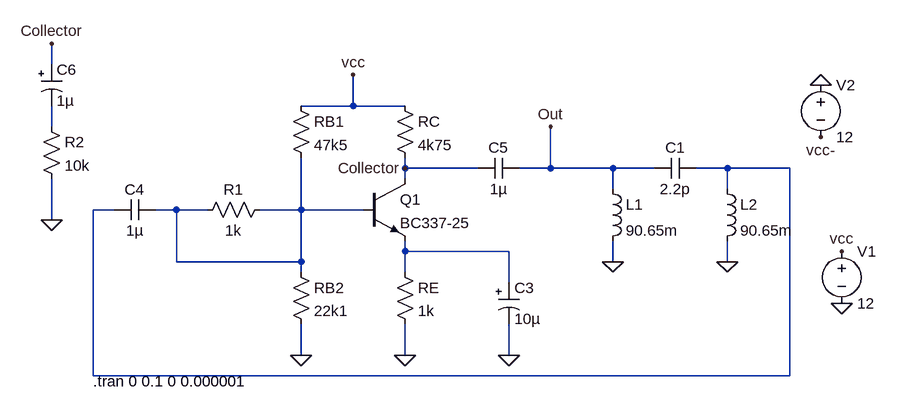
[diagram p0: schematic FuckItWeGoHartley.asc]
FuckItWeGoHartley.asc, the LTspice schematic file:
Version 4
SHEET 1 880 680
WIRE -528 -48 -528 -80
WIRE -64 16 -64 -32
WIRE -64 16 -144 16
WIRE 16 16 -64 16
WIRE -528 48 -528 16
WIRE 16 112 16 96
WIRE 128 112 16 112
WIRE 240 112 240 48
WIRE 240 112 192 112
WIRE 336 112 240 112
WIRE 400 112 336 112
WIRE 512 112 464 112
WIRE 608 112 512 112
WIRE 16 128 16 112
WIRE 336 144 336 112
WIRE 512 144 512 112
WIRE -432 176 -464 176
WIRE -336 176 -368 176
WIRE -288 176 -336 176
WIRE -144 176 -144 96
WIRE -144 176 -208 176
WIRE -48 176 -144 176
WIRE -528 192 -528 128
WIRE 16 240 16 224
WIRE 176 240 16 240
WIRE -336 256 -336 176
WIRE -144 256 -144 176
WIRE -144 256 -336 256
WIRE 336 256 336 224
WIRE 512 256 512 224
WIRE -144 272 -144 256
WIRE 16 272 16 240
WIRE 176 288 176 240
WIRE -144 400 -144 352
WIRE 16 400 16 352
WIRE 176 400 176 352
WIRE -464 432 -464 176
WIRE 608 432 608 112
WIRE 608 432 -464 432
FLAG -64 -32 vcc
FLAG 688 240 vcc
FLAG 688 320 0
FLAG 240 48 Out
FLAG 656 -16 0
FLAG 656 64 vcc-
FLAG 512 256 0
FLAG 336 256 0
FLAG 176 400 0
FLAG 16 400 0
FLAG -144 400 0
FLAG 16 112 Collector
FLAG -528 192 0
FLAG -528 -80 Collector
SYMBOL res -160 0 R0
SYMATTR InstName RB1
SYMATTR Value 47k5
SYMBOL res 0 0 R0
SYMATTR InstName RC
SYMATTR Value 4k75
SYMBOL res 0 256 R0
SYMATTR InstName RE
SYMATTR Value 1k
SYMBOL res -160 256 R0
SYMATTR InstName RB2
SYMATTR Value 22k1
SYMBOL polcap 160 288 R0
SYMATTR InstName C3
SYMATTR Value 10µ
SYMBOL voltage 688 224 R0
WINDOW 123 0 0 Left 0
WINDOW 39 0 0 Left 0
SYMATTR InstName V1
SYMATTR Value 12
SYMBOL voltage 656 -32 R0
WINDOW 123 0 0 Left 0
WINDOW 39 0 0 Left 0
SYMATTR InstName V2
SYMATTR Value 12
SYMBOL polcap -544 -48 R0
SYMATTR InstName C6
SYMATTR Value 1µ
SYMBOL res -544 32 R0
SYMATTR InstName R2
SYMATTR Value 10k
SYMBOL cap -368 160 R90
WINDOW 0 0 32 VBottom 2
WINDOW 3 32 32 VTop 2
SYMATTR InstName C4
SYMATTR Value 1µ
SYMBOL cap 192 96 R90
WINDOW 0 0 32 VBottom 2
WINDOW 3 32 32 VTop 2
SYMATTR InstName C5
SYMATTR Value 1µ
SYMBOL npn -48 128 R0
SYMATTR InstName Q1
SYMATTR Value BC337-25
SYMBOL cap 464 96 R90
WINDOW 0 0 32 VBottom 2
WINDOW 3 32 32 VTop 2
SYMATTR InstName C1
SYMATTR Value 2.2p
SYMBOL ind 320 128 R0
SYMATTR InstName L1
SYMATTR Value 90.65m
SYMBOL ind 496 128 R0
SYMATTR InstName L2
SYMATTR Value 90.65m
SYMBOL res -192 160 R90
WINDOW 0 0 56 VBottom 2
WINDOW 3 32 56 VTop 2
SYMATTR InstName R1
SYMATTR Value 1k
TEXT -464 440 Left 2 !.tran 0 0.1 0 0.000001

The netlist it stands for:
* FuckItWeGoHartley.asc
RB1 vcc N003 47k5
RC vcc Collector 4k75
RE N004 0 1k
RB2 N003 0 22k1
C3 N004 0 10µ
V1 vcc 0 12
V2 0 vcc- 12
C6 Collector N001 1µ
R2 N001 0 10k
C4 N003 N002 1µ
C5 Out Collector 1µ
Q1 Collector N003 N004 0 BC337-25
C1 N002 Out 2.2p
L1 Out 0 90.65m
L2 N002 0 90.65m
R1 N003 N003 1k
.model NPN NPN
.model PNP PNP
.lib standard.bjt
.tran 0 0.1 0 0.000001
.backanno
.end